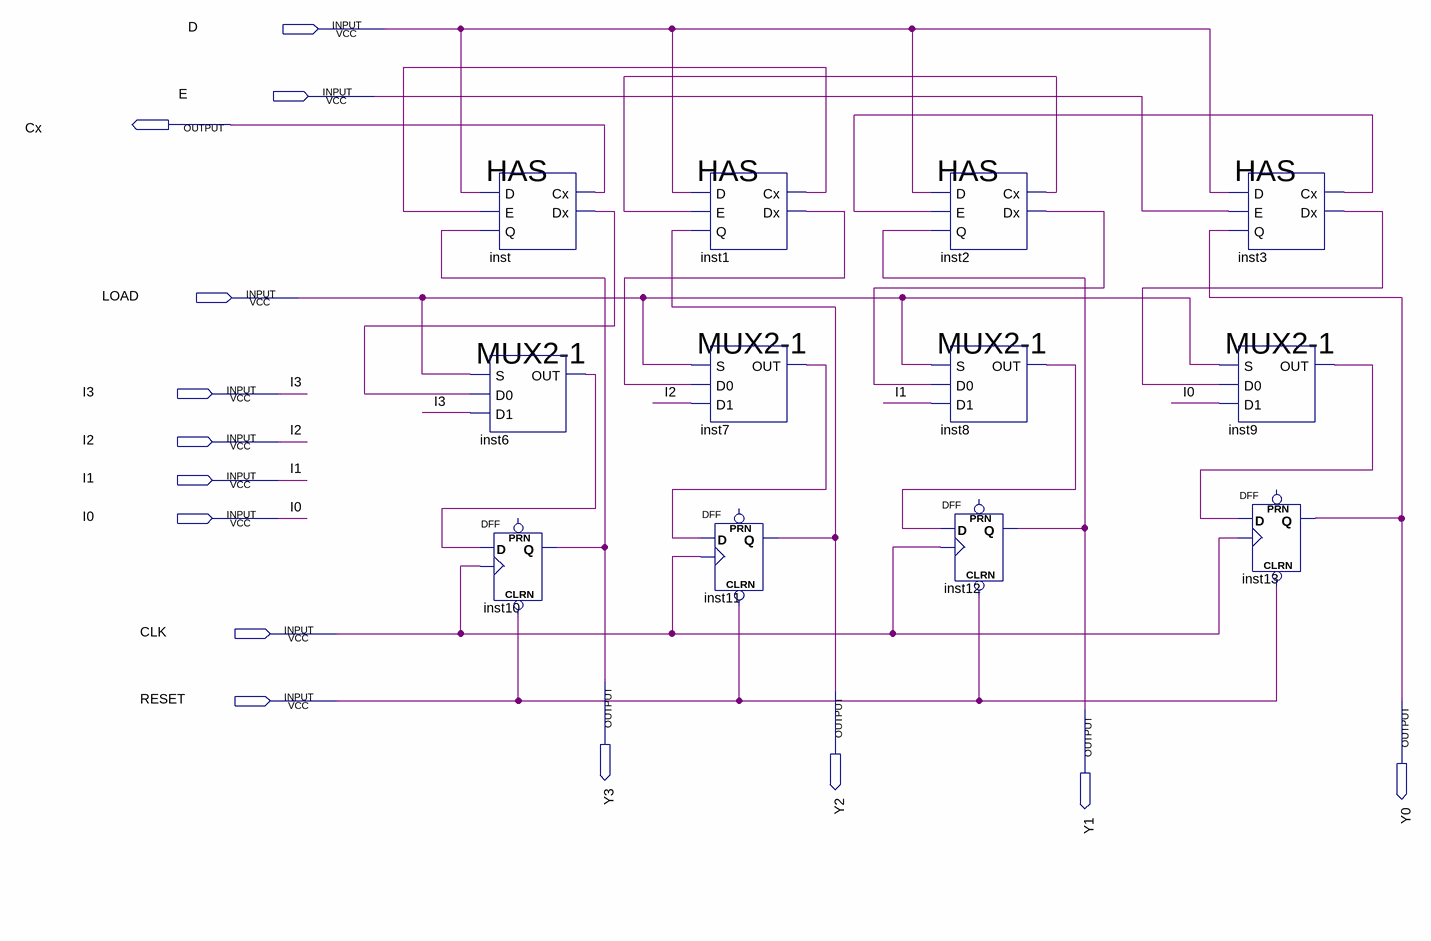
[diagram p0: schematic sheet]
// Quartus schematic 4bit.bdf as structural Verilog: 12 symbols, 14 pins
module \4bit  (
  input  D,
  input  E,
  input  LOAD,
  input  I3,
  input  I2,
  input  I1,
  input  I0,
  input  CLK,
  input  RESET,
  output Cx,
  output Y3,
  output Y2,
  output Y0,
  output Y1
);

  wire inst1_cx, inst1_dx, inst2_cx, inst2_dx, inst3_cx, inst3_dx, inst6_out, inst7_out, inst8_out,
       inst9_out, inst_dx;

  HAS inst (.D(D), .E(inst1_cx), .Q(Y3), .Cx(Cx), .Dx(inst_dx));
  \MUX2-1  inst6 (.S(LOAD), .D0(inst_dx), .D1(I3), .OUT(inst6_out));
  DFF inst10 (.CLRN(RESET), .CLK(CLK), .D(inst6_out), .Q(Y3));  // open: PRN
  HAS inst1 (.D(D), .E(inst2_cx), .Q(Y2), .Cx(inst1_cx), .Dx(inst1_dx));
  \MUX2-1  inst7 (.S(LOAD), .D0(inst1_dx), .D1(I2), .OUT(inst7_out));
  DFF inst11 (.CLRN(RESET), .CLK(CLK), .D(inst7_out), .Q(Y2));  // open: PRN
  HAS inst2 (.D(D), .E(inst3_cx), .Q(Y1), .Cx(inst2_cx), .Dx(inst2_dx));
  \MUX2-1  inst8 (.S(LOAD), .D0(inst2_dx), .D1(I1), .OUT(inst8_out));
  DFF inst12 (.CLRN(RESET), .CLK(CLK), .D(inst8_out), .Q(Y1));  // open: PRN
  HAS inst3 (.D(D), .E(E), .Q(Y0), .Cx(inst3_cx), .Dx(inst3_dx));
  \MUX2-1  inst9 (.S(LOAD), .D0(inst3_dx), .D1(I0), .OUT(inst9_out));
  DFF inst13 (.CLRN(RESET), .CLK(CLK), .D(inst9_out), .Q(Y0));  // open: PRN
endmodule
